# Altium schematic sheet 0193_GPP_MUX_A.SchDoc
size 848 x 558 mm
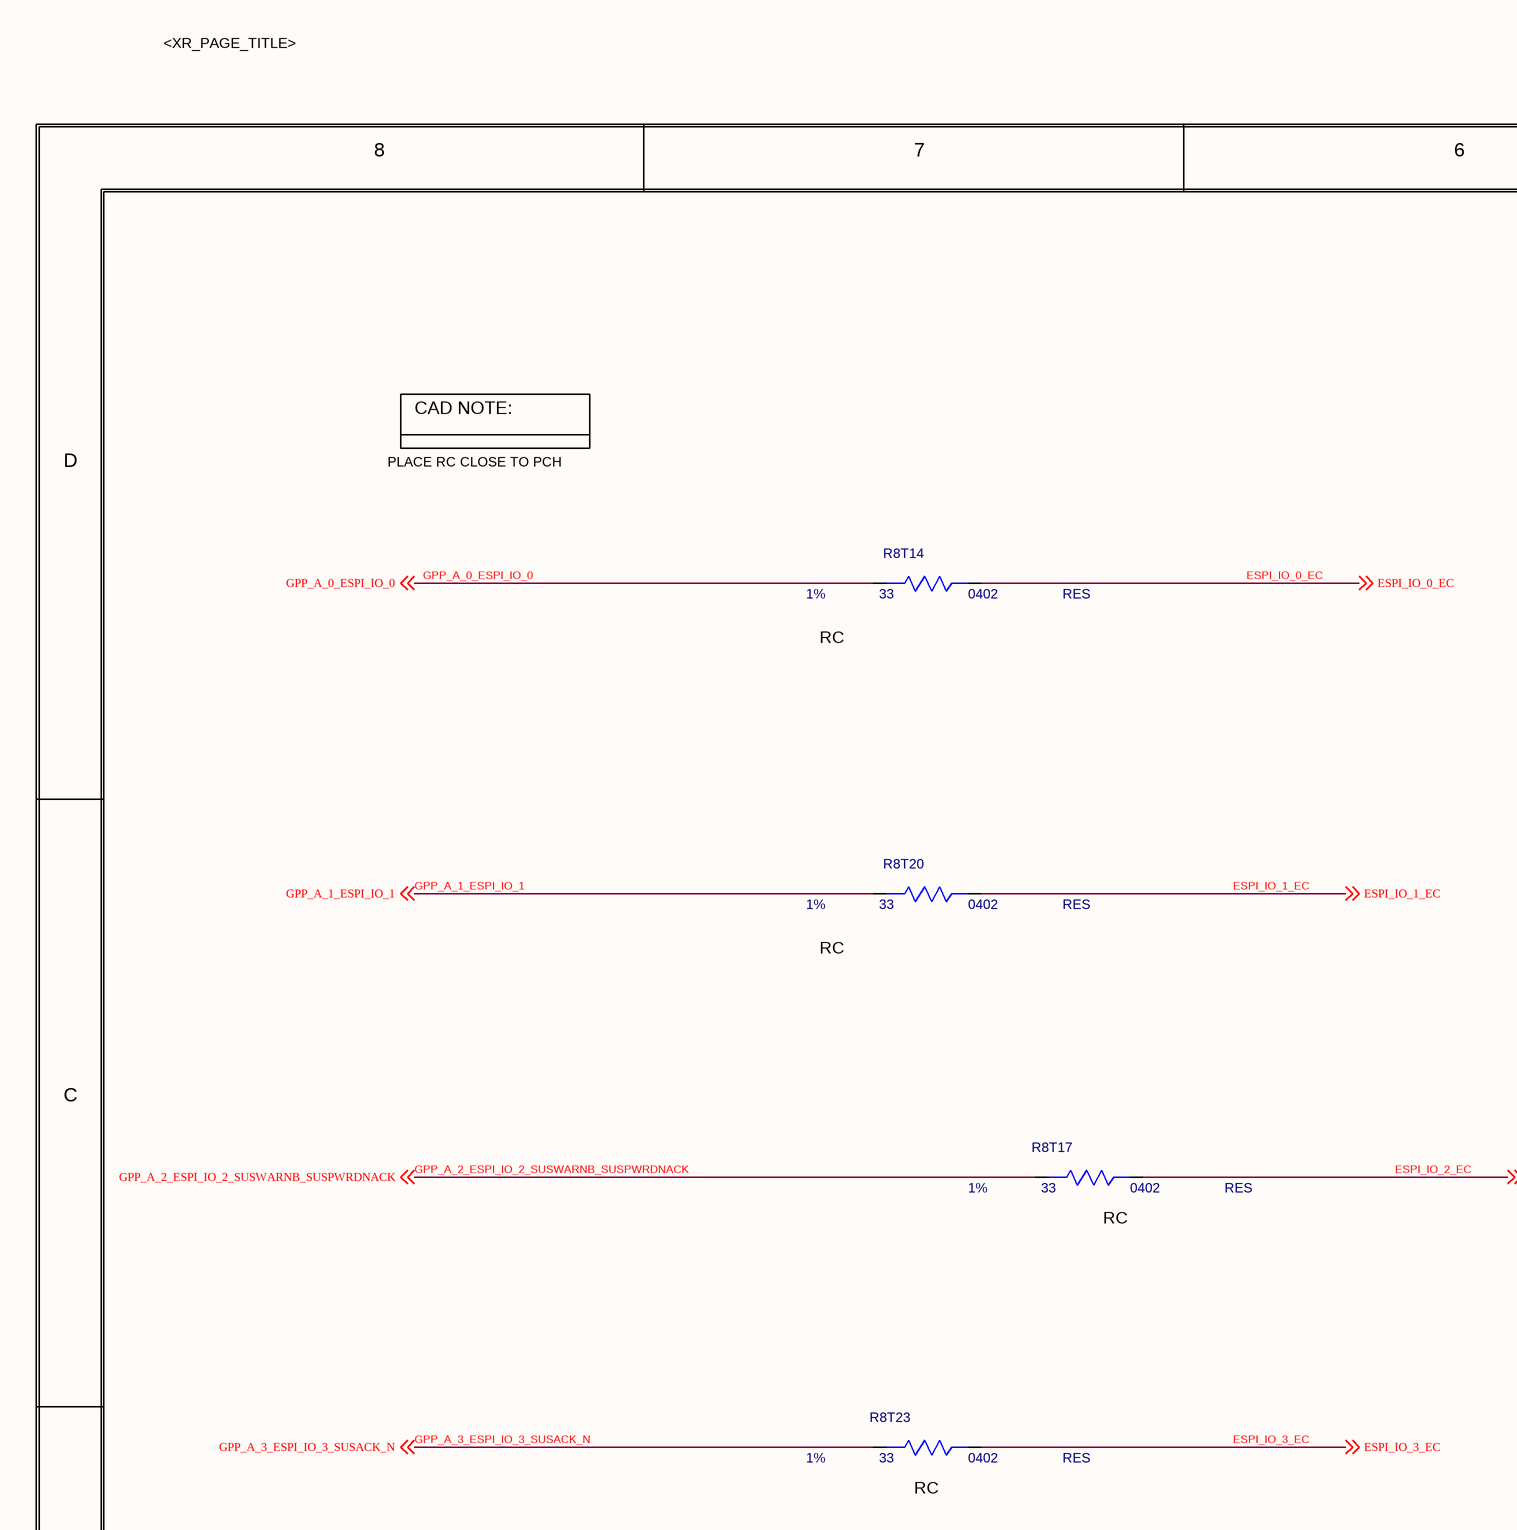
[diagram p0: 0193_GPP_MUX_A.SchDoc, top left]
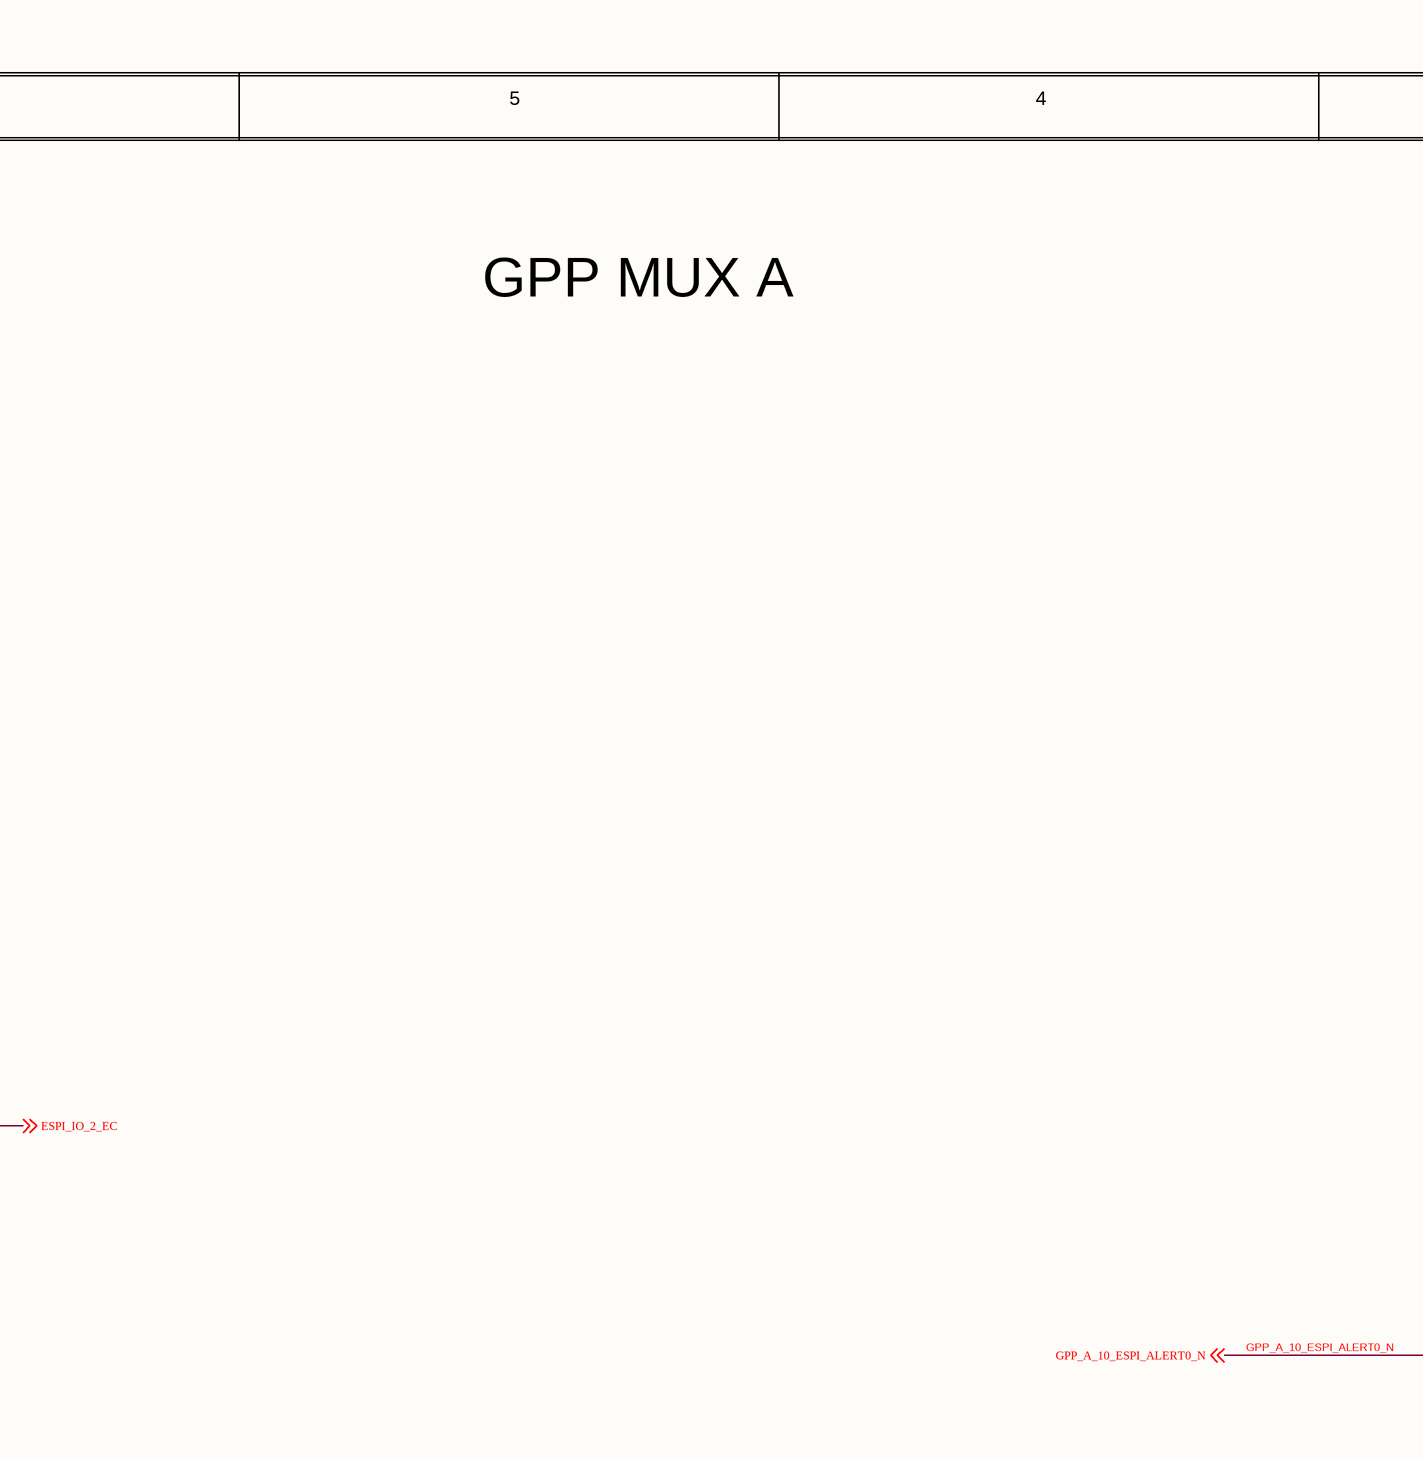
[diagram p1: 0193_GPP_MUX_A.SchDoc, top middle]
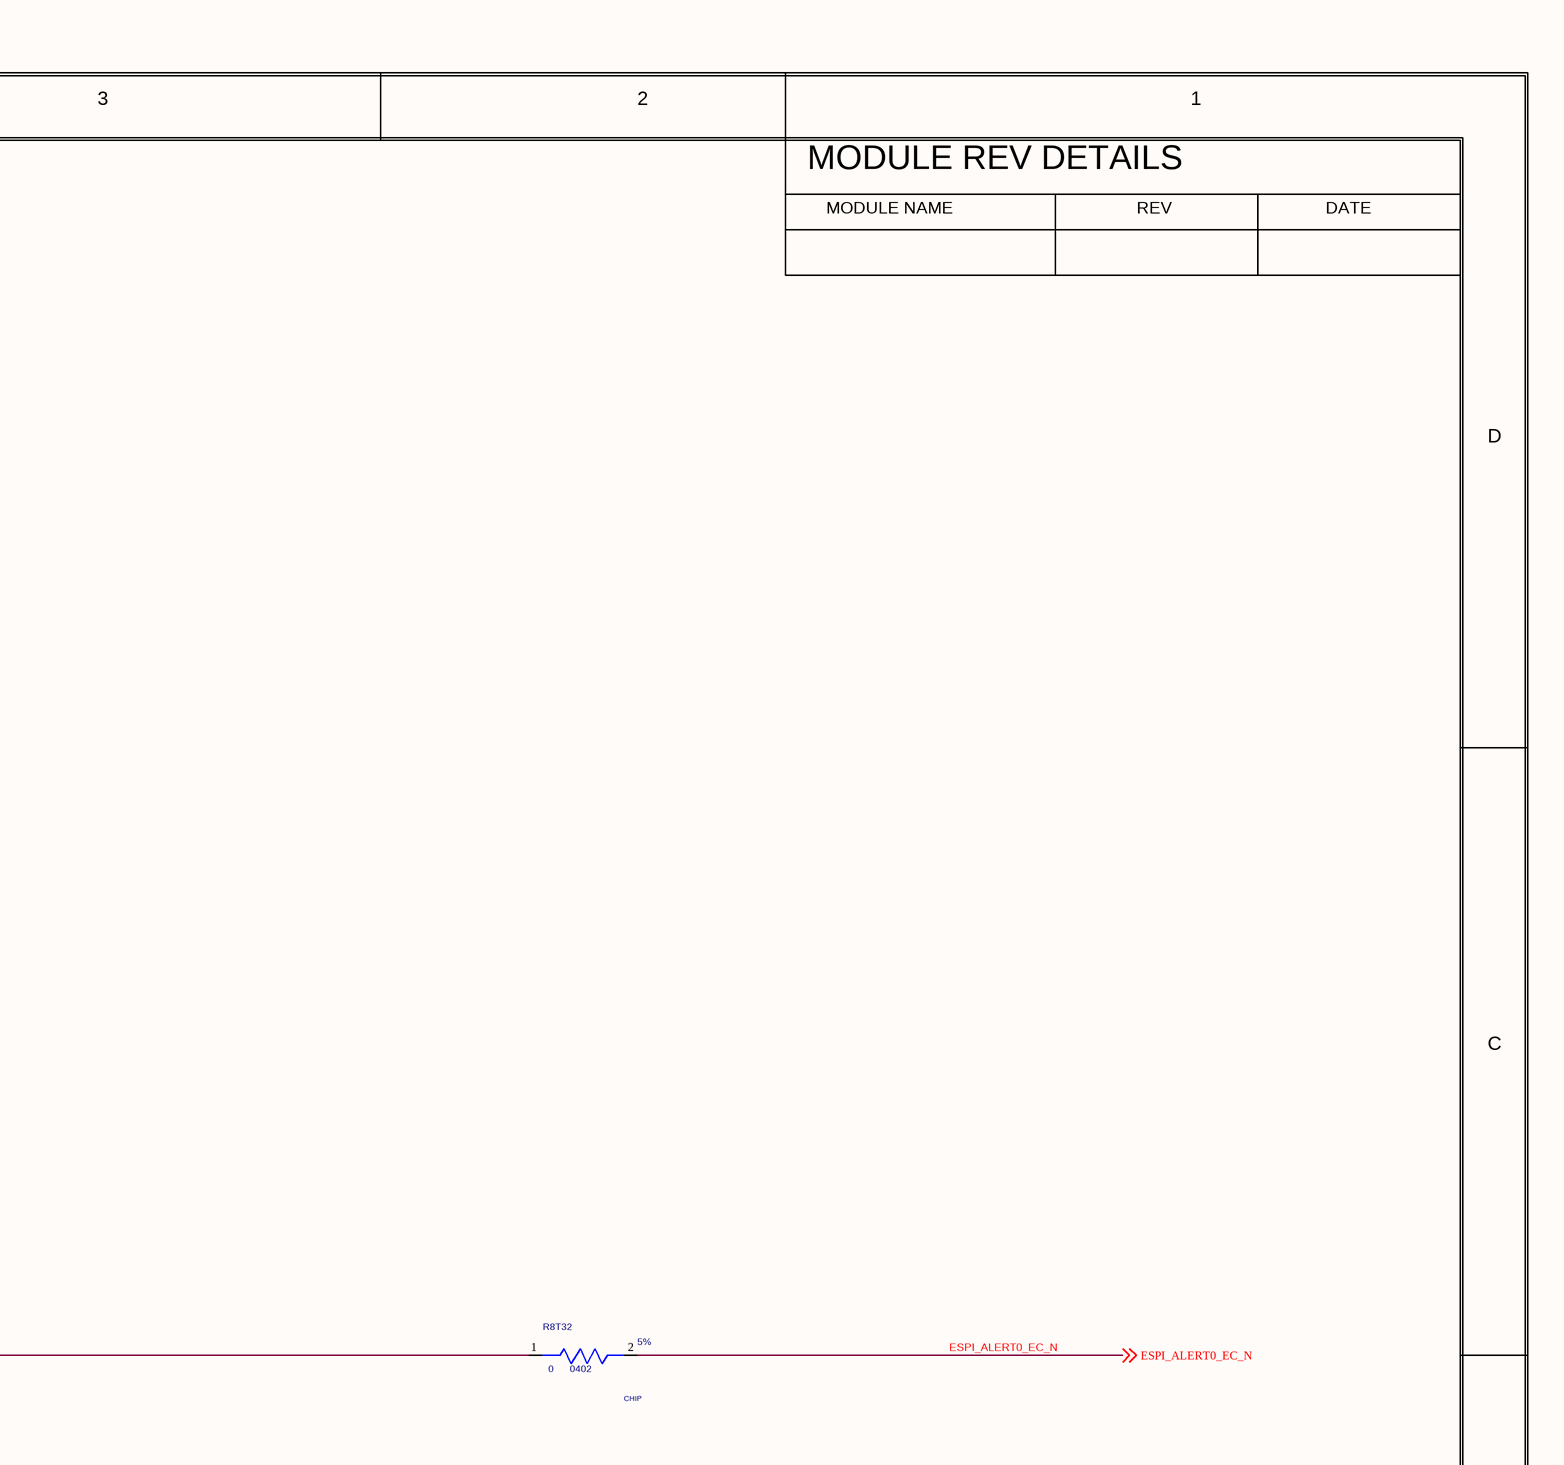
[diagram p2: 0193_GPP_MUX_A.SchDoc, top right]
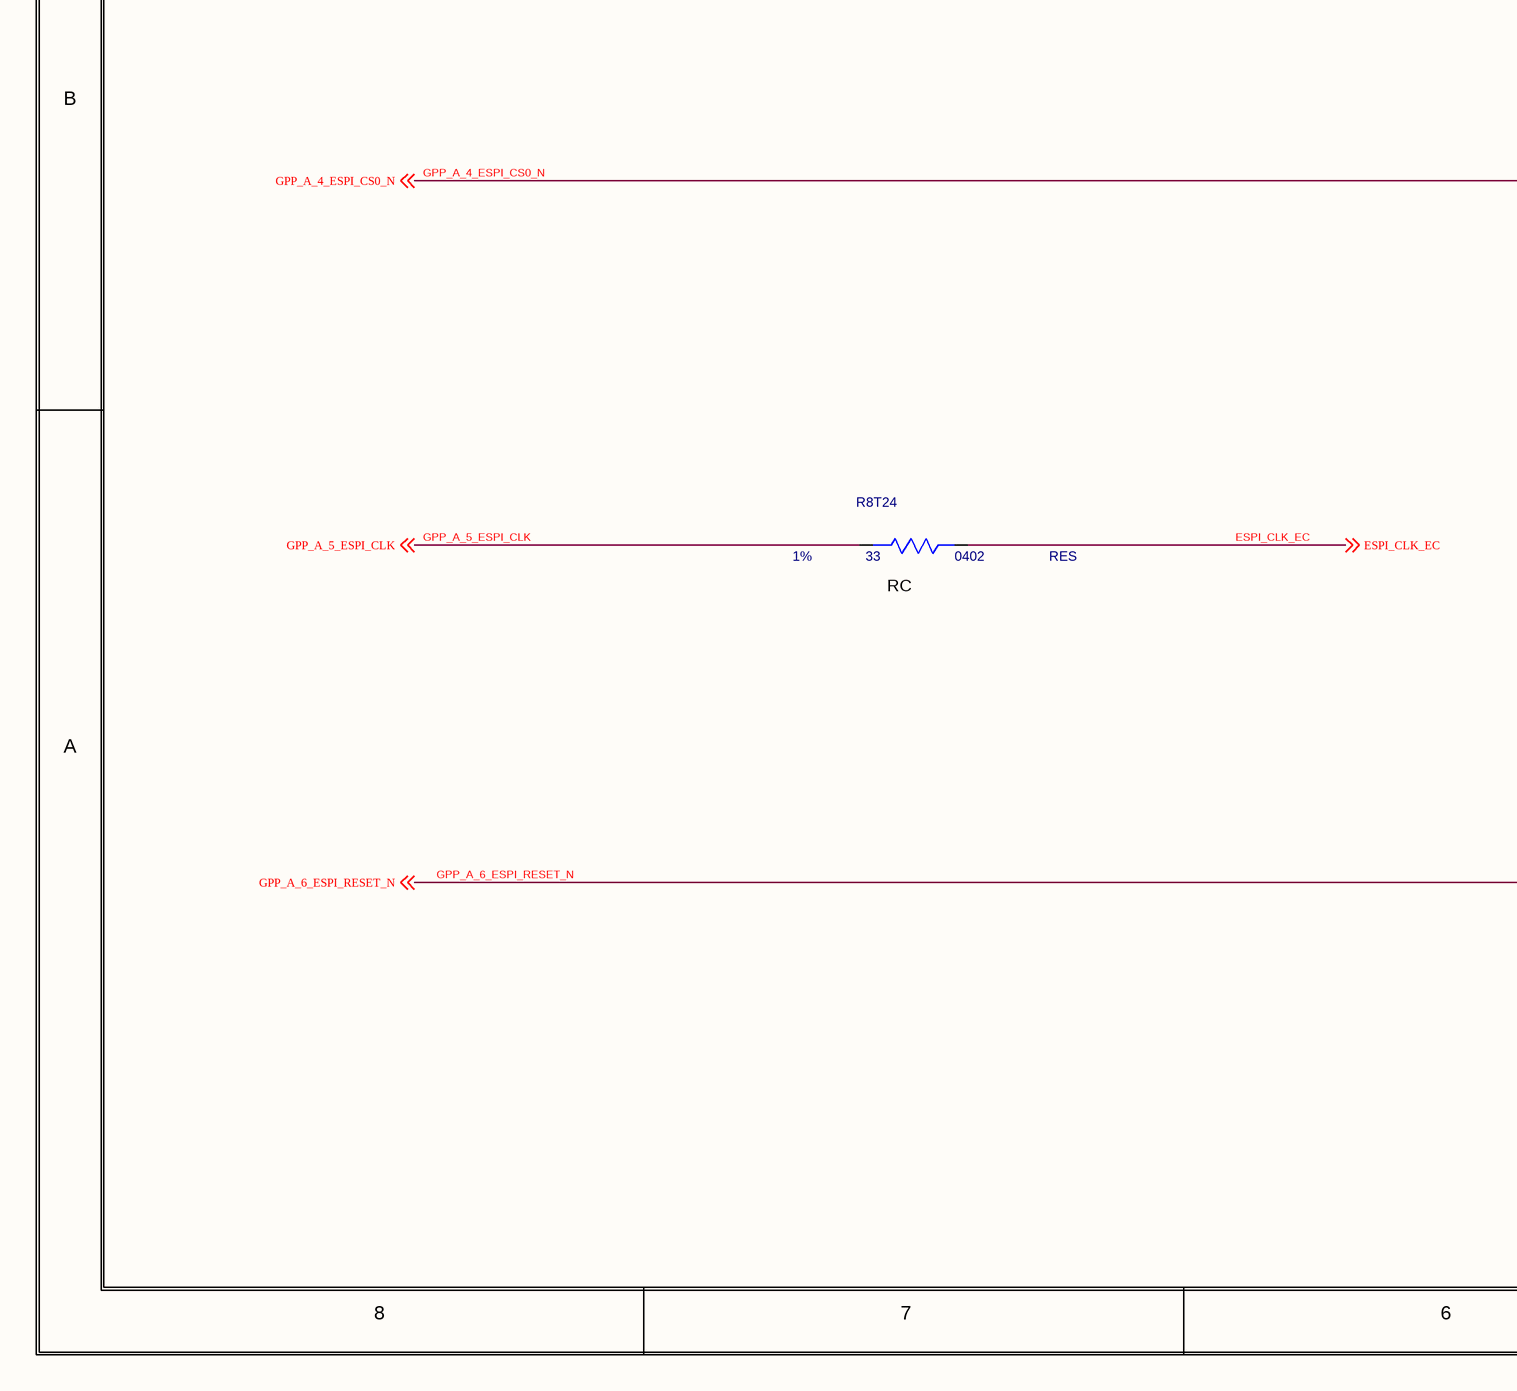
[diagram p3: 0193_GPP_MUX_A.SchDoc, bottom left]
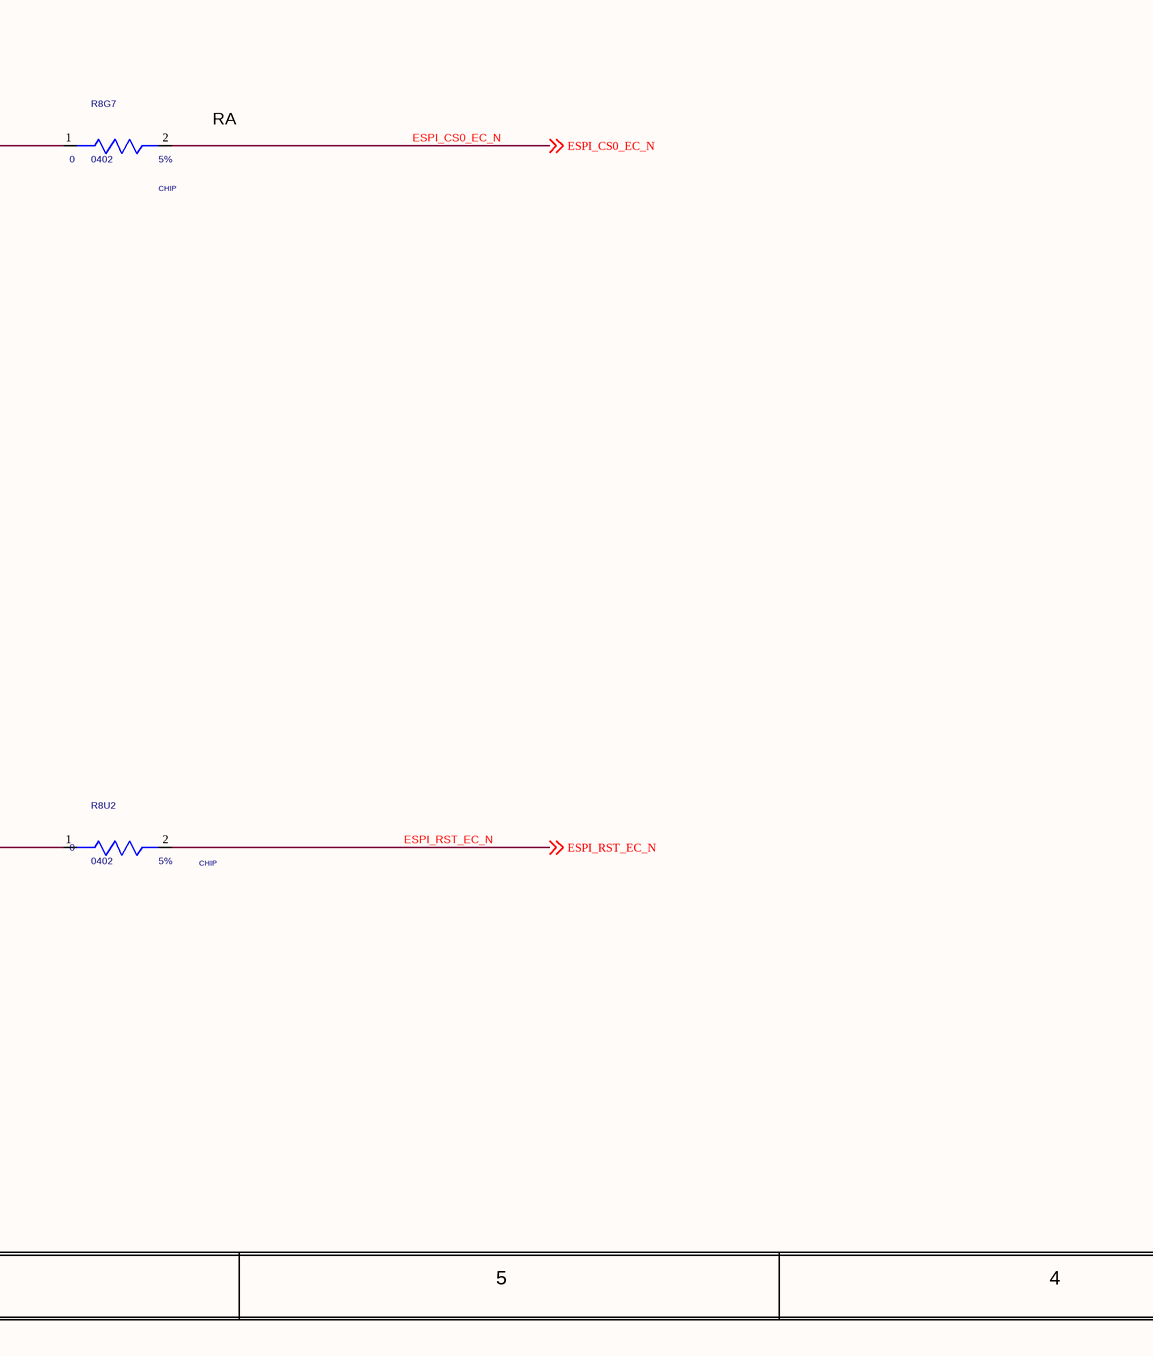
[diagram p4: 0193_GPP_MUX_A.SchDoc, bottom middle]
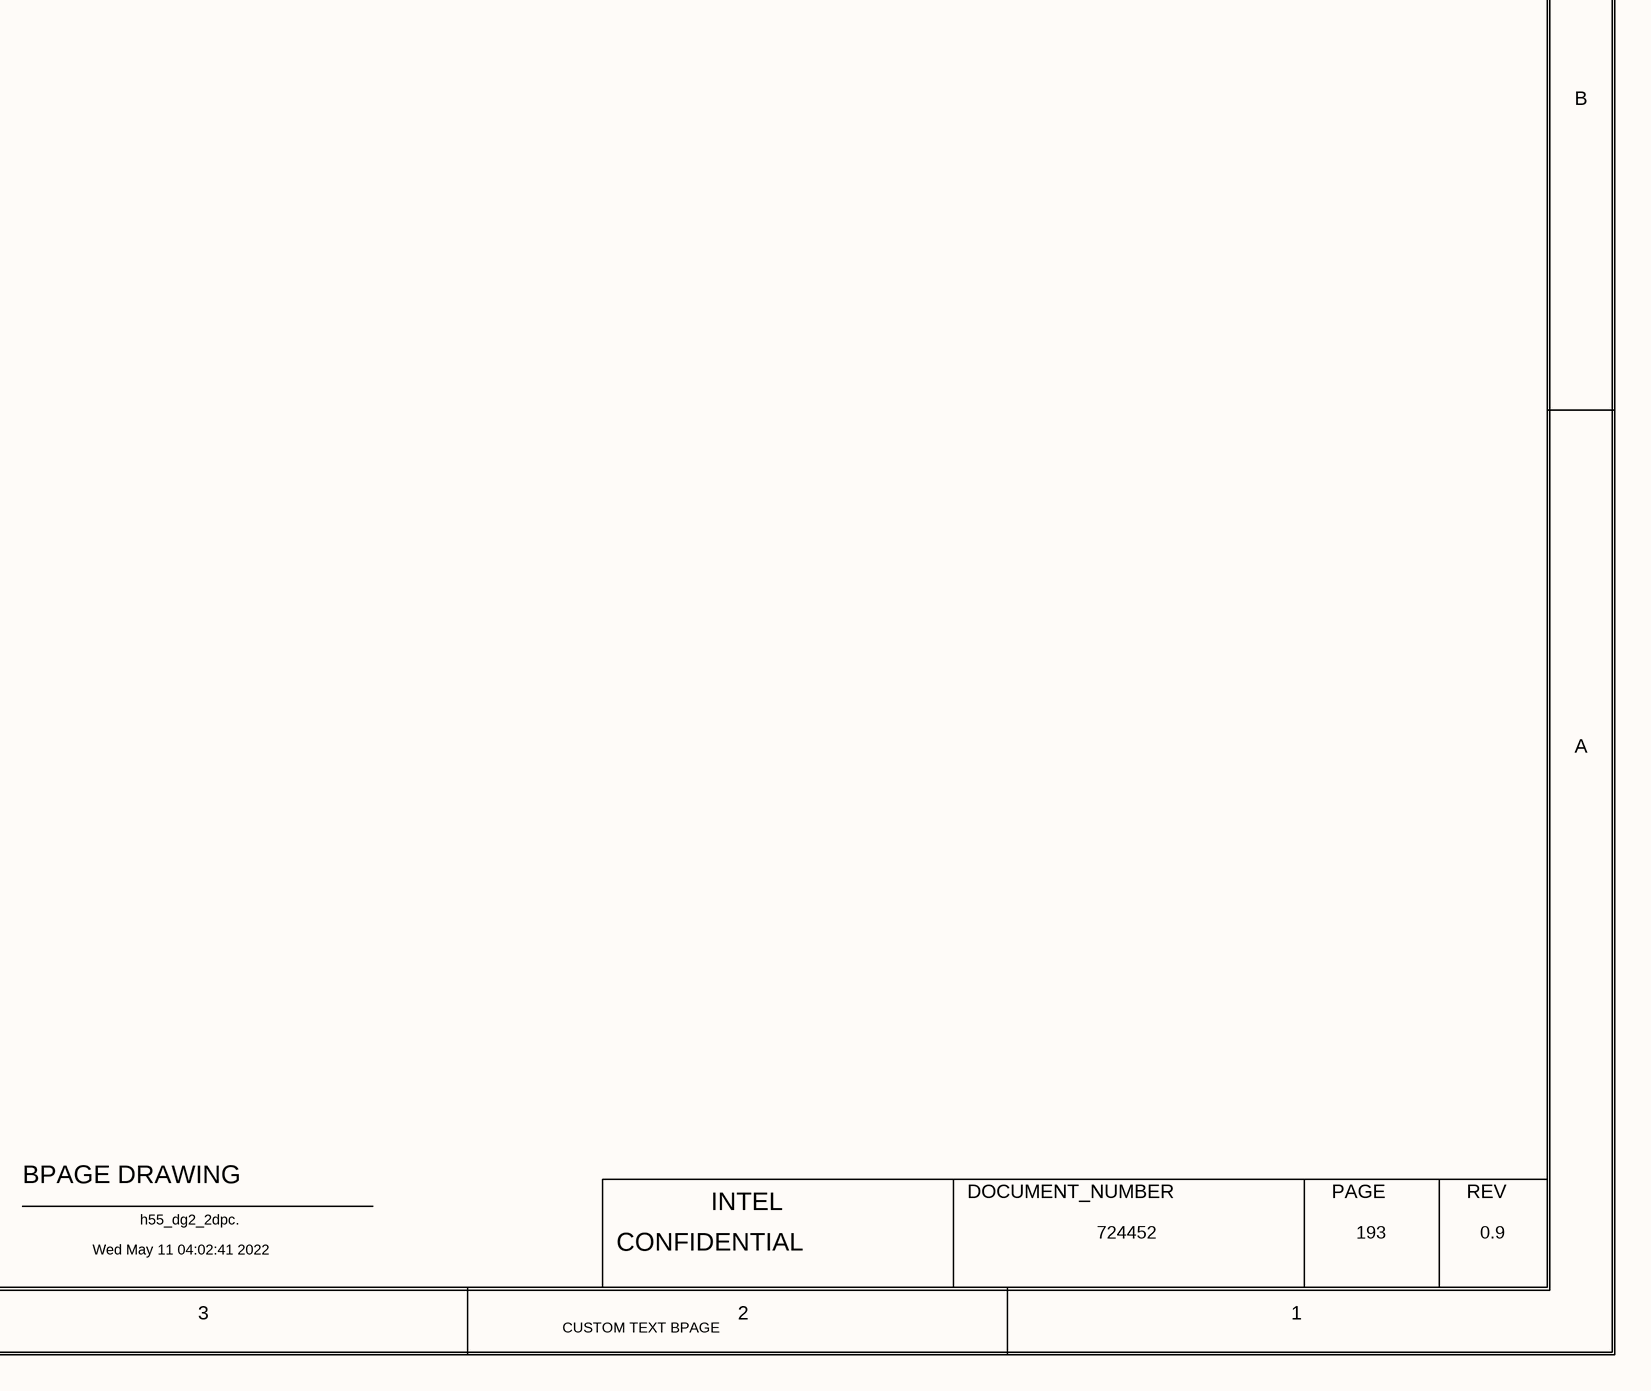
[diagram p5: 0193_GPP_MUX_A.SchDoc, bottom right]

## Parts
R8G7  0  MATERIAL: CHIP  PACK_TYPE: 0402  TOLERANCE: 5%  [SMR0402IA]
R8T14  33  MATERIAL: RES  PACK_TYPE: 0402  TOLERANCE: 1%  [TK0_SM0402_1100X550_MA]
R8T17  33  MATERIAL: RES  PACK_TYPE: 0402  TOLERANCE: 1%  [TK0_SM0402_1100X550_MA]
R8T20  33  MATERIAL: RES  PACK_TYPE: 0402  TOLERANCE: 1%  [TK0_SM0402_1100X550_MA]
R8T23  33  MATERIAL: RES  PACK_TYPE: 0402  TOLERANCE: 1%  [TK0_SM0402_1100X550_MA]
R8T24  33  MATERIAL: RES  PACK_TYPE: 0402  TOLERANCE: 1%  [TK0_SM0402_1100X550_MA]
R8T32  0  MATERIAL: CHIP  PACK_TYPE: 0402  TOLERANCE: 5%  [SMR0402IA]
R8U2  0  MATERIAL: CHIP  PACK_TYPE: 0402  TOLERANCE: 5%  [SMR0402IA]

## Nets
ESPI_ALERT0_EC_N: R8T32.2(B) ; off-sheet ESPI_ALERT0_EC_N
ESPI_CLK_EC: R8T24.2(B) ; off-sheet ESPI_CLK_EC
ESPI_CS0_EC_N: R8G7.2(B) ; off-sheet ESPI_CS0_EC_N
ESPI_IO_0_EC: R8T14.2(B) ; off-sheet ESPI_IO_0_EC
ESPI_IO_1_EC: R8T20.2(B) ; off-sheet ESPI_IO_1_EC
ESPI_IO_2_EC: R8T17.2(B) ; off-sheet ESPI_IO_2_EC
ESPI_IO_3_EC: R8T23.2(B) ; off-sheet ESPI_IO_3_EC
ESPI_RST_EC_N: R8U2.2(B) ; off-sheet ESPI_RST_EC_N
GPP_A_0_ESPI_IO_0: R8T14.1(A) ; off-sheet GPP_A_0_ESPI_IO_0
GPP_A_1_ESPI_IO_1: R8T20.1(A) ; off-sheet GPP_A_1_ESPI_IO_1
GPP_A_2_ESPI_IO_2_SUSWARNB_SUSPWRDNACK: R8T17.1(A) ; off-sheet GPP_A_2_ESPI_IO_2_SUSWARNB_SUSPWRDNACK
GPP_A_3_ESPI_IO_3_SUSACK_N: R8T23.1(A) ; off-sheet GPP_A_3_ESPI_IO_3_SUSACK_N
GPP_A_4_ESPI_CS0_N: R8G7.1(A) ; off-sheet GPP_A_4_ESPI_CS0_N
GPP_A_5_ESPI_CLK: R8T24.1(A) ; off-sheet GPP_A_5_ESPI_CLK
GPP_A_6_ESPI_RESET_N: R8U2.1(A) ; off-sheet GPP_A_6_ESPI_RESET_N
GPP_A_10_ESPI_ALERT0_N: R8T32.1(A) ; off-sheet GPP_A_10_ESPI_ALERT0_N

## Notes on the sheet
- <XR_PAGE_TITLE>
- 8
- 7
- 6
- 5
- 4
- 3
- 2
- 1
- MODULE REV DETAILS
- MODULE NAME
- REV
- DATE
- GPP MUX A
- CAD NOTE:
- D
- PLACE RC CLOSE TO PCH
- RC
- C
- (near R8T17) RC
- (near R8T23) RC
- B
- RA
- (near R8T24) RC
- A
- BPAGE DRAWING
- INTEL
- DOCUMENT_NUMBER
- PAGE
- Wed May 11 04:02:41 2022
- h55_dg2_2dpc.
- CONFIDENTIAL
- 724452
- 193
- 0.9
- CUSTOM TEXT BPAGE

## Library data of the parts
R8G7 = RES#1: PART_NUMBER: A93549-001; CHIPS_PART_NAME: RES; CDS_PHYS_PART_NAME: RES_0402-A93549-001,CHIP,0,5%,1/16W,LPDB,GENERIC; WATTAGE: 1/16W; OriginalSymbolOrigin: (-75,25); XY: (-4975,2600); VER: 1; PHYS_PAGE: 193; LOCATION: R8G7; IP: GENERIC; FP_TECH: LPDB; DRAWING: @RVP1_ADL_SB_ADP_S_DDR5_SODIMM_2DPC_LIB.H55_DG2_2DPC(SCH_1):PAGE562; CDS_LIB: discrete; PCB Footprint: SMR0402IA; SEC_TYPE: 0402; ROT: 0; CDS_PART_NAME: RES_0402-A93549-001,CHIP,0,5%,1/16W,LPDB,GENERIC; CDS_LOCATION: R8G7; ASI_MODEL: A93549-001
R8T14 = RES_2#1: PART_NUMBER: A93548-503; CHIPS_PART_NAME: RES_2; CDS_PHYS_PART_NAME: RES_2_0402-A93548-503,RES,33,1%,0.0625W,TK0,GENERIC; BOM_USE: STUFF; CDS_LMAN_SYM_OUTLINE: -50,50,50,-50; FP_TECH: TK0; IP: GENERIC; ROOM: NONE; WATTAGE: 0.0625W; OriginalSymbolOrigin: (-75,25); XY: (-6225,4825); VER: 1; ROT: 0; PHYS_PAGE: 193; LOCATION: R8T14; DRAWING: @RVP1_ADL_SB_ADP_S_DDR5_SODIMM_2DPC_LIB.H55_DG2_2DPC(SCH_1):PAGE562; CDS_LIB: discrete_2; VARIANT: ?; PCB Footprint: TK0_SM0402_1100X550_MA; CDS_PART_NAME: RES_2_0402-A93548-503,RES,33,1%,0.0625W,TK0,GENERIC; CDS_LOCATION: R8T14
R8T17 = RES_2#1: PART_NUMBER: A93548-503; CHIPS_PART_NAME: RES_2; CDS_PHYS_PART_NAME: RES_2_0402-A93548-503,RES,33,1%,0.0625W,TK0,GENERIC; BOM_USE: STUFF; CDS_LMAN_SYM_OUTLINE: -50,50,50,-50; FP_TECH: TK0; IP: GENERIC; ROOM: NONE; WATTAGE: 0.0625W; OriginalSymbolOrigin: (-75,25); XY: (-5925,3725); VER: 1; ROT: 0; PHYS_PAGE: 193; LOCATION: R8T17; DRAWING: @RVP1_ADL_SB_ADP_S_DDR5_SODIMM_2DPC_LIB.H55_DG2_2DPC(SCH_1):PAGE562; CDS_LIB: discrete_2; VARIANT: ?; PCB Footprint: TK0_SM0402_1100X550_MA; CDS_PART_NAME: RES_2_0402-A93548-503,RES,33,1%,0.0625W,TK0,GENERIC; CDS_LOCATION: R8T17
R8T20 = RES_2#1: PART_NUMBER: A93548-503; CHIPS_PART_NAME: RES_2; CDS_PHYS_PART_NAME: RES_2_0402-A93548-503,RES,33,1%,0.0625W,TK0,GENERIC; BOM_USE: STUFF; CDS_LMAN_SYM_OUTLINE: -50,50,50,-50; FP_TECH: TK0; IP: GENERIC; ROOM: NONE; WATTAGE: 0.0625W; OriginalSymbolOrigin: (-75,25); XY: (-6225,4250); VER: 1; ROT: 0; PHYS_PAGE: 193; LOCATION: R8T20; DRAWING: @RVP1_ADL_SB_ADP_S_DDR5_SODIMM_2DPC_LIB.H55_DG2_2DPC(SCH_1):PAGE562; CDS_LIB: discrete_2; VARIANT: ?; PCB Footprint: TK0_SM0402_1100X550_MA; CDS_PART_NAME: RES_2_0402-A93548-503,RES,33,1%,0.0625W,TK0,GENERIC; CDS_LOCATION: R8T20
R8T23 = RES_2#1: PART_NUMBER: A93548-503; CHIPS_PART_NAME: RES_2; CDS_PHYS_PART_NAME: RES_2_0402-A93548-503,RES,33,1%,0.0625W,TK0,GENERIC; BOM_USE: STUFF; CDS_LMAN_SYM_OUTLINE: -50,50,50,-50; FP_TECH: TK0; IP: GENERIC; ROOM: NONE; WATTAGE: 0.0625W; OriginalSymbolOrigin: (-75,25); XY: (-6225,3225); VER: 1; ROT: 0; PHYS_PAGE: 193; LOCATION: R8T23; DRAWING: @RVP1_ADL_SB_ADP_S_DDR5_SODIMM_2DPC_LIB.H55_DG2_2DPC(SCH_1):PAGE562; CDS_LIB: discrete_2; VARIANT: ?; PCB Footprint: TK0_SM0402_1100X550_MA; CDS_PART_NAME: RES_2_0402-A93548-503,RES,33,1%,0.0625W,TK0,GENERIC; CDS_LOCATION: R8T23
R8T24 = RES_2#1: PART_NUMBER: A93548-503; CHIPS_PART_NAME: RES_2; CDS_PHYS_PART_NAME: RES_2_0402-A93548-503,RES,33,1%,0.0625W,TK0,GENERIC; BOM_USE: STUFF; CDS_LMAN_SYM_OUTLINE: -50,50,50,-50; FP_TECH: TK0; IP: GENERIC; ROOM: NONE; WATTAGE: 0.0625W; OriginalSymbolOrigin: (-75,25); XY: (-6250,1925); VER: 1; ROT: 0; PHYS_PAGE: 193; LOCATION: R8T24; DRAWING: @RVP1_ADL_SB_ADP_S_DDR5_SODIMM_2DPC_LIB.H55_DG2_2DPC(SCH_1):PAGE562; CDS_LIB: discrete_2; VARIANT: ?; PCB Footprint: TK0_SM0402_1100X550_MA; CDS_PART_NAME: RES_2_0402-A93548-503,RES,33,1%,0.0625W,TK0,GENERIC; CDS_LOCATION: R8T24
R8T32 = RES#1: PART_NUMBER: A93549-001; CHIPS_PART_NAME: RES; CDS_PHYS_PART_NAME: RES_0402-A93549-001,CHIP,0,5%,1/16W,LPDB,GENERIC; WATTAGE: 1/16W; OriginalSymbolOrigin: (-75,25); XY: (-1375,3300); VER: 1; PHYS_PAGE: 193; LOCATION: R8T32; IP: GENERIC; FP_TECH: LPDB; DRAWING: @RVP1_ADL_SB_ADP_S_DDR5_SODIMM_2DPC_LIB.H55_DG2_2DPC(SCH_1):PAGE562; CDS_LIB: discrete; PCB Footprint: SMR0402IA; SEC_TYPE: 0402; ROT: 0; CDS_PART_NAME: RES_0402-A93549-001,CHIP,0,5%,1/16W,LPDB,GENERIC; CDS_LOCATION: R8T32; ASI_MODEL: A93549-001
R8U2 = RES#1: PART_NUMBER: A93549-001; CHIPS_PART_NAME: RES; CDS_PHYS_PART_NAME: RES_0402-A93549-001,CHIP,0,5%,1/16W,LPDB,GENERIC; WATTAGE: 1/16W; OriginalSymbolOrigin: (-75,25); XY: (-4975,1300); VER: 1; PHYS_PAGE: 193; LOCATION: R8U2; IP: GENERIC; FP_TECH: LPDB; DRAWING: @RVP1_ADL_SB_ADP_S_DDR5_SODIMM_2DPC_LIB.H55_DG2_2DPC(SCH_1):PAGE562; CDS_LIB: discrete; PCB Footprint: SMR0402IA; SEC_TYPE: 0402; ROT: 0; CDS_PART_NAME: RES_0402-A93549-001,CHIP,0,5%,1/16W,LPDB,GENERIC; CDS_LOCATION: R8U2; ASI_MODEL: A93549-001